# Altium project Project.PrjPCB
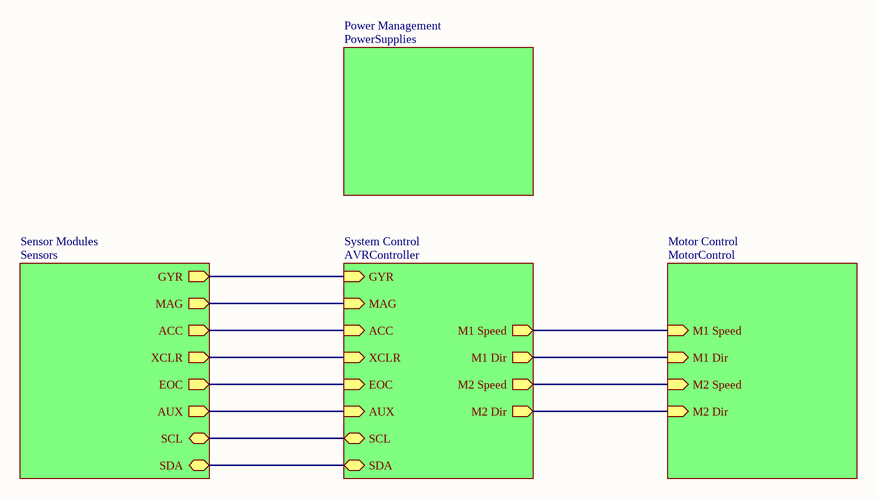
[diagram p0: Project.SchDoc]
5 sheets, 65 parts. Net scope: hierarchical (ports join the sheet entries above them; power ports are global).
Board file: Project.PcbDoc
Sheets:
  Project.SchDoc
    System Control = AVRController.SchDoc
    Motor Control = MotorControl.SchDoc
    Sensor Modules = Sensors.SchDoc
    Power Management = PowerSupplies.SchDoc

## Sheet Project.SchDoc
size A4

### Sub-sheets
Motor Control = MotorControl: M1 Speed (in), M1 Dir (in), M2 Speed (in), M2 Dir (in)
Power Management = PowerSupplies: no entries
Sensor Modules = Sensors: GYR (out), MAG (out), ACC (out), XCLR (out), EOC (out), AUX (out), SCL (bidir), SDA (bidir)
System Control = AVRController: GYR (in), MAG (in), ACC (in), XCLR (in), EOC (in), AUX (in), SCL (bidir), SDA (bidir), M1 Speed (out), M1 Dir (out), M2 Speed (out), M2 Dir (out)

### Nets
NetR12_2: sheet System Control/M1 Dir, sheet Motor Control/M1 Dir
NetR14_2: sheet System Control/M2 Dir, sheet Motor Control/M2 Dir
NetR17_1: sheet System Control/SDA, sheet Sensor Modules/SDA
NetR18_1: sheet System Control/SCL, sheet Sensor Modules/SCL
NetU1_2: sheet System Control/GYR, sheet Sensor Modules/GYR
NetU1_3: sheet System Control/MAG, sheet Sensor Modules/MAG
NetU1_4: sheet System Control/ACC, sheet Sensor Modules/ACC
NetU1_5: sheet System Control/XCLR, sheet Sensor Modules/XCLR
NetU1_7: sheet System Control/M1 Speed, sheet Motor Control/M1 Speed
NetU1_8: sheet System Control/M2 Speed, sheet Motor Control/M2 Speed
NetU1_12: sheet System Control/EOC, sheet Sensor Modules/EOC
(unnamed): sheet System Control/AUX, sheet Sensor Modules/AUX

## Sheet AVRController.SchDoc
size A4
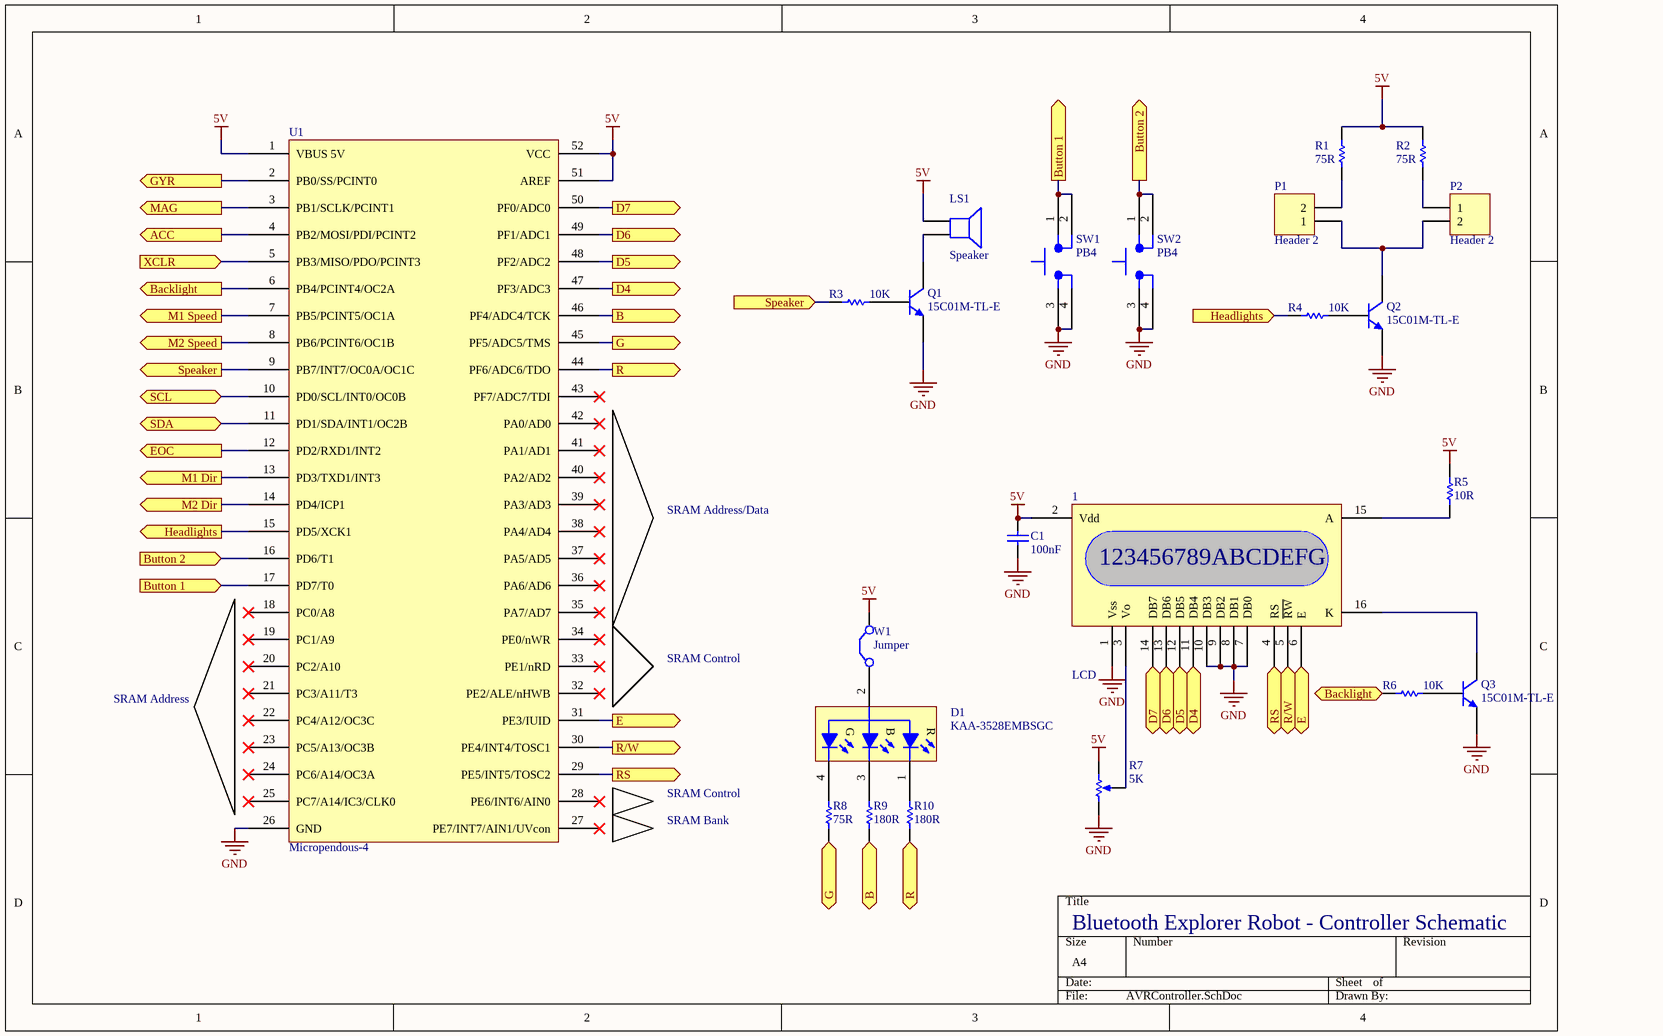
[diagram p1: AVRController.SchDoc]

### Parts
1  LCD  [LCD_PADS]
C1  value 100nF  [2012[0805]]
D1  KAA-3528EMBSGC  [KAA-3528EMBSGC]
LS1  Speaker  [PIN2]
P1  Header 2  [HDR1X2]
P2  Header 2  [HDR1X2]
Q1  15C01M-TL-E  [SOT323]
Q2  15C01M-TL-E  [SOT323]
Q3  15C01M-TL-E  [SOT323]
R1  value 75R  [2012[0805]]  (hidden comment: Res Semi)
R2  value 75R  [2012[0805]]  (hidden comment: Res Semi)
R3  value 10K  [2012[0805]]  (hidden comment: Res Semi)
R4  value 10K  [2012[0805]]  (hidden comment: Res Semi)
R5  value 10R  [2012[0805]]
R6  value 10K  [2012[0805]]  (hidden comment: Res Semi)
R7  value 5K  [POT1]
R8  value 75R  [2012[0805]]  (hidden comment: Res Semi)
R9  value 180R  [2012[0805]]  (hidden comment: Res Semi)
R10  value 180R  [2012[0805]]  (hidden comment: Res Semi)
SW1  PB4  [PB2x2]
SW2  PB4  [PB2x2]
U1  Micropendous-4  [Micropendous-4]
W1  Jumper  [RAD-0.2]

### Ports
ACC (out), B (in), B (out), Backlight (in), Backlight (out), Button 1 (in), Button 1 (out), Button 2 (in), Button 2 (out), D4 (in), D4 (out), D5 (in), D5 (out), D6 (in), D6 (out), D7 (in), D7 (out), E (in), E (out), EOC (out), G (in), G (out), GYR (out), Headlights (in), Headlights (out), M1 Dir (out), M1 Speed (out), M2 Dir (out), M2 Speed (out), MAG (out), R (in), R (out), R/W (in), R/W (out), RS (in), RS (out), SCL (bidir), SDA (bidir), Speaker (in), Speaker (out), XCLR (in)

### Nets
5V: 1.2(Vdd) C1.1 LS1.1 R1.2 R2.2 R5.2 R7.2(BOT) U1.1(VBUS_5V) U1.51(AREF) U1.52(VCC) W1.2(C2)
GND: 1.1(Vss) 1.7(DB0) 1.8(DB1) 1.9(DB2) 1.10(DB3) C1.2 Q1.1(E) Q2.1(E) Q3.1(E) R7.1(TOP) SW1.3 SW1.4 SW2.3 SW2.4 U1.26(GND)
Net1_3: 1.3(Vo) R7.3(TAP)
Net1_4: 1.4(RS) U1.29(PE5/INT5/TOSC2) ; port RS
Net1_5: 1.5(~{RW}) U1.30(PE4/INT4/TOSC1) ; port R/W
Net1_6: 1.6(E) U1.31(PE3/IUID) ; port E
Net1_11: 1.11(DB4) U1.47(PF3/ADC3) ; port D4
Net1_12: 1.12(DB5) U1.48(PF2/ADC2) ; port D5
Net1_13: 1.13(DB6) U1.49(PF1/ADC1) ; port D6
Net1_14: 1.14(DB7) U1.50(PF0/ADC0) ; port D7
Net1_15: 1.15(A) R5.1
Net1_16: 1.16(K) Q3.3(C)
NetD1_1: D1.1(R) R10.2
NetD1_2: D1.2(A2) W1.1(C1)
NetD1_3: D1.3(B) R9.2
NetD1_4: D1.4(G) R8.2
NetLS1_2: LS1.2 Q1.3(C)
NetP1_1: P1.1 P2.2 Q2.3(C)
NetP1_2: P1.2 R1.1
NetP2_1: P2.1 R2.1
NetQ1_2: Q1.2(B) R3.2
NetQ2_2: Q2.2(B) R4.2
NetQ3_2: Q3.2(B) R6.2
NetR3_1: R3.1 U1.9(PB7/INT7/OC0A/OC1C) ; port Speaker
NetR4_1: R4.1 U1.15(PD5/XCK1) ; port Headlights
NetR6_1: R6.1 U1.6(PB4/PCINT4/OC2A) ; port Backlight
NetR8_1: R8.1 U1.45(PF5/ADC5/TMS) ; port G
NetR9_1: R9.1 U1.46(PF4/ADC4/TCK) ; port B
NetR10_1: R10.1 U1.44(PF6/ADC6/TDO) ; port R
NetR12_2: U1.13(PD3/TXD1/INT3) ; port M1 Dir
NetR14_2: U1.14(PD4/ICP1) ; port M2 Dir
NetR17_1: U1.11(PD1/SDA/INT1/OC2B) ; port SDA
NetR18_1: U1.10(PD0/SCL/INT0/OC0B) ; port SCL
NetSW1_1: SW1.1 SW1.2 U1.17(PD7/T0) ; port Button 1
NetSW2_1: SW2.1 SW2.2 U1.16(PD6/T1) ; port Button 2
NetU1_2: U1.2(PB0/SS/PCINT0) ; port GYR
NetU1_3: U1.3(PB1/SCLK/PCINT1) ; port MAG
NetU1_4: U1.4(PB2/MOSI/PDI/PCINT2) ; port ACC
NetU1_5: U1.5(PB3/MISO/PDO/PCINT3) ; port XCLR
NetU1_7: U1.7(PB5/PCINT5/OC1A) ; port M1 Speed
NetU1_8: U1.8(PB6/PCINT6/OC1B) ; port M2 Speed
NetU1_12: U1.12(PD2/RXD1/INT2) ; port EOC

Not connected (* = marked no-connect by the designer): U1 18(PC0/A8)* 19(PC1/A9)* 20(PC2/A10)* 21(PC3/A11/T3)* 22(PC4/A12/OC3C)* 23(PC5/A13/OC3B)* 24(PC6/A14/OC3A)* 25(PC7/A14/IC3/CLK0)* 27(PE7/INT7/AIN1/UVcon)* 28(PE6/INT6/AIN0)* 32(PE2/ALE/nHWB)* 33(PE1/nRD)* 34(PE0/nWR)* 35(PA7/AD7)* 36(PA6/AD6)* 37(PA5/AD5)* 38(PA4/AD4)* 39(PA3/AD3)* 40(PA2/AD2)* 41(PA1/AD1)* 42(PA0/AD0)* 43(PF7/ADC7/TDI)*

### Notes on the sheet
- SRAM Address/Data
- SRAM Address
- SRAM Control
- SRAM Bank
- Bluetooth Explorer Robot - Controller Schematic
- (in symbol LCD) 123456789ABCDEFG

### Library data of the parts
C1 = Cap Semi: Capacitor (Semiconductor SIM Model); Published: 8-Jun-2000; LatestRevisionDate: 17-Jul-2002; LatestRevisionNote: Re-released for DXP Platform.; PackageReference: C1206; Publisher: Altium Limited
D1 = S1204RGBSDJC: Ultra-Bright RGB Tri-color LED Lamp, 4-Lead 1204-size SMD; Published: 14-Mar-2008; DatasheetVersion: Aug-2006; PackageVersion: Aug-2006; PackageReference: LED1204; Publisher: Altium Limited; PackageDescription: SM Tri-color LED Lamp, 4-Leads 1204-size; ComponentLink1Description: Manufacturer Link; ComponentLink1URL: http://www.sansentech.com/; ComponentLink2Description: Datasheet; ComponentLink2URL: http://www.sansentech.com/LED/S1204RGBSDJC.pdf
LS1 = Speaker: Loudspeaker; Published: 24-Mar-1999; LatestRevisionDate: 17-Jul-2002; LatestRevisionNote: Re-released for DXP Platform.; PackageReference: PIN2; Publisher: Altium Limited
P1 P2 = Header 2: Header, 2-Pin; LatestRevisionDate: 17-Jul-2002; LatestRevisionNote: Re-released for DXP Platform.; Publisher: Altium Limited
Q1-Q3 = 2N3904: NPN General Purpose Amplifier; Published: 8-Jun-2000; LatestRevisionDate: 15-Jan-2003; LatestRevisionNote: PCB Footprint 'BCY-W3/D4.7' replaced; DatasheetVersion: 1997; PackageVersion: Sep-1998; PackageReference: TO-92A; Publisher: Altium Limited; Code_JEDEC: TO-92A; ComponentLink1Description: Manufacturer Link; ComponentLink1URL: http://www.fairchildsemi.com/; ComponentLink2Description: Datasheet; ComponentLink2URL: http://www.fairchildsemi.com/ds/2N%2F2N3904.pdf
R1-R4 R6 R8-R10 = Res Semi: Semiconductor Resistor; Published: 8-Jun-2000; LatestRevisionDate: 17-Jul-2002; LatestRevisionNote: Re-released for DXP Platform.; PackageReference: AXIAL-0.5; Publisher: Altium Limited
R5 = Res1: Resistor; Published: 8-Jun-2000; LatestRevisionDate: 17-Jul-2002; LatestRevisionNote: Re-released for DXP Platform.; PackageReference: AXIAL-0.3; Publisher: Altium Limited
R7 = RPot: Potentiometer; Sim Note: Enter the Resistance value and the set point into parameter fields.; Set Position: 0.5; Published: 8-Jun-2000; LatestRevisionDate: 17-Jul-2002; LatestRevisionNote: Re-released for DXP Platform.; PackageReference: VR5; Publisher: Altium Limited
W1 = Jumper: Jumper Wire; Published: 24-Mar-1999; LatestRevisionDate: 17-Jul-2002; LatestRevisionNote: Re-released for DXP Platform.; PackageReference: RAD-0.2; Publisher: Altium Limited

## Sheet MotorControl.SchDoc
size A4
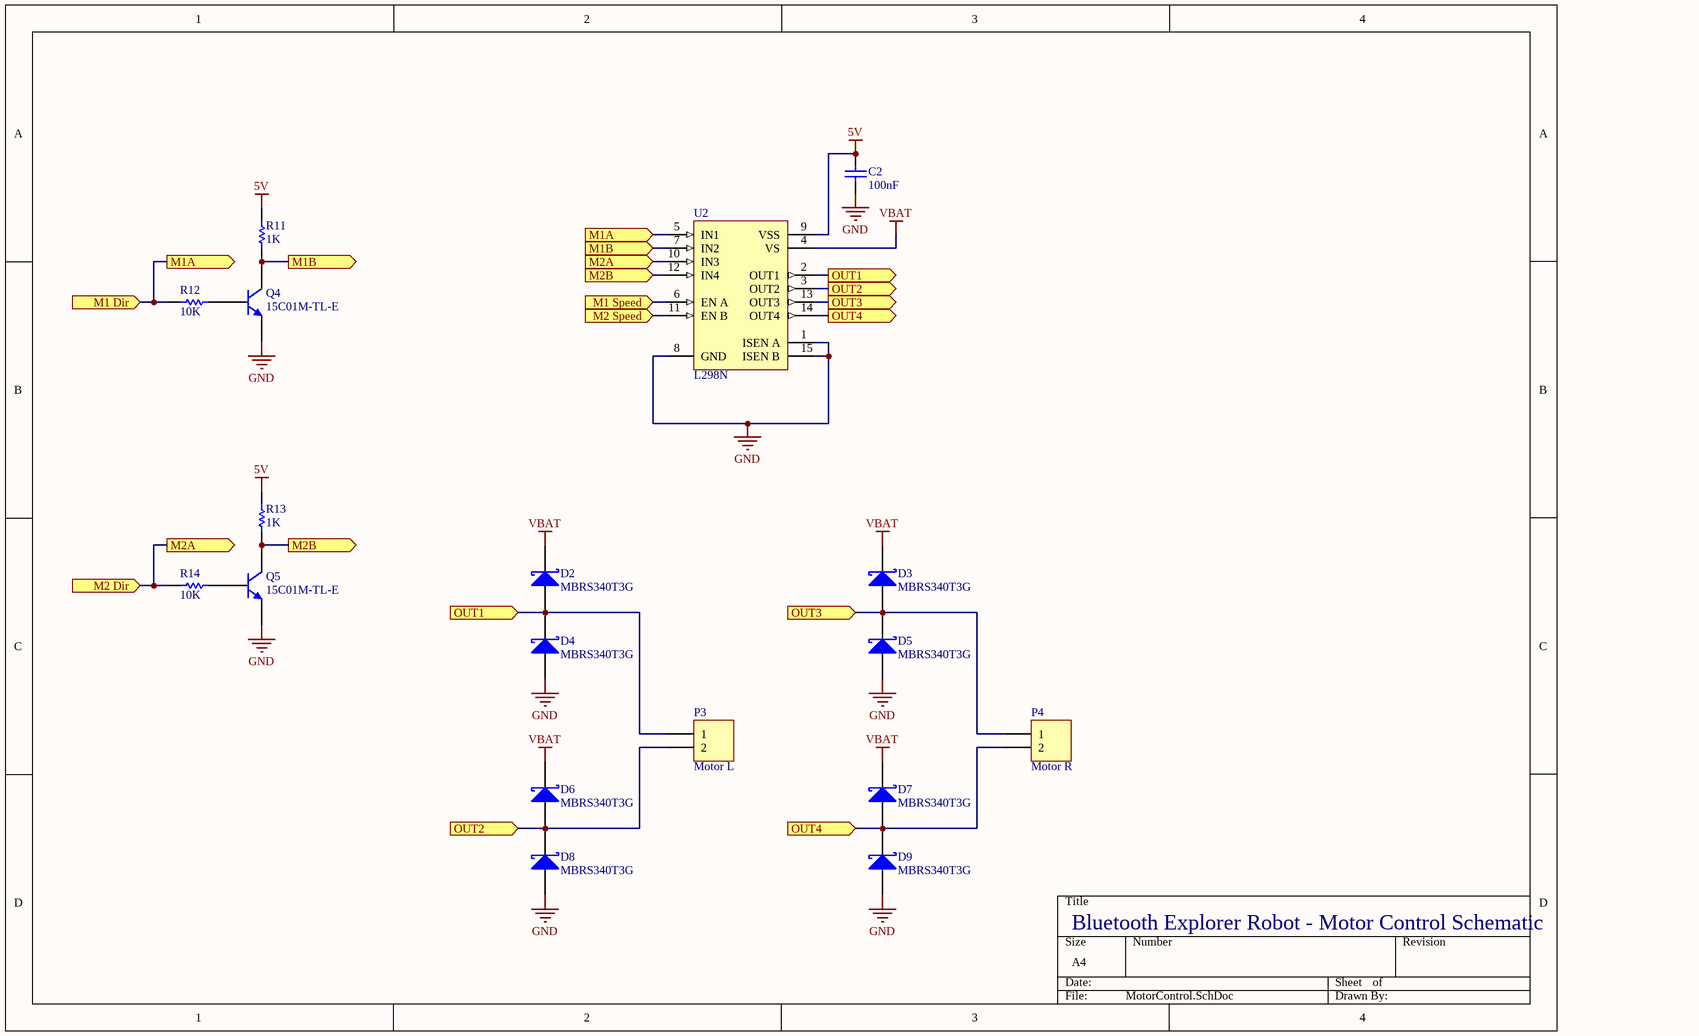
[diagram p2: MotorControl.SchDoc]

### Parts
C2  value 100nF  [0805]
D2  MBRS340T3G  [SMC]
D3  MBRS340T3G  [SMC]
D4  MBRS340T3G  [SMC]
D5  MBRS340T3G  [SMC]
D6  MBRS340T3G  [SMC]
D7  MBRS340T3G  [SMC]
D8  MBRS340T3G  [SMC]
D9  MBRS340T3G  [SMC]
P3  Motor L  [PCB Screw Connector]
P4  Motor R  [PCB Screw Connector]
Q4  15C01M-TL-E  [SOT323]
Q5  15C01M-TL-E  [SOT323]
R11  value 1K  [2012[0805]]  (hidden comment: Res Semi)
R12  value 10K  [2012[0805]]  (hidden comment: Res Semi)
R13  value 1K  [2012[0805]]  (hidden comment: Res Semi)
R14  value 10K  [2012[0805]]  (hidden comment: Res Semi)
U2  L298N  [Multiwatt15V]

### Ports
M1 Dir (in), M1 Speed (in), M1A (in), M1A (out), M1B (in), M1B (out), M2 Dir (in), M2 Speed (in), M2A (in), M2A (out), M2B (in), M2B (out), OUT1 (in), OUT1 (out), OUT2 (in), OUT2 (out), OUT3 (in), OUT3 (out), OUT4 (in), OUT4 (out)

### Nets
5V: C2.1 R11.2 R13.2 U2.9(VSS)
GND: C2.2 D4.1(A) D5.1(A) D8.1(A) D9.1(A) Q4.1(E) Q5.1(E) U2.1(ISEN_A) U2.8(GND) U2.15(ISEN_B)
VBAT: D2.2(K) D3.2(K) D6.2(K) D7.2(K) U2.4(VS)
NetD2_1: D2.1(A) D4.2(K) P3.1 U2.2(OUT1) ; port OUT1
NetD3_1: D3.1(A) D5.2(K) P4.1 U2.13(OUT3) ; port OUT3
NetD6_1: D6.1(A) D8.2(K) P3.2 U2.3(OUT2) ; port OUT2
NetD7_1: D7.1(A) D9.2(K) P4.2 U2.14(OUT4) ; port OUT4
NetQ4_2: Q4.2(B) R12.1
NetQ4_3: Q4.3(C) R11.1 U2.7(IN2) ; port M1B
NetQ5_2: Q5.2(B) R14.1
NetQ5_3: Q5.3(C) R13.1 U2.12(IN4) ; port M2B
NetR12_2: R12.2 U2.5(IN1) ; port M1 Dir, port M1A
NetR14_2: R14.2 U2.10(IN3) ; port M2 Dir, port M2A
NetU1_7: U2.6(EN_A) ; port M1 Speed
NetU1_8: U2.11(EN_B) ; port M2 Speed

### Notes on the sheet
- Bluetooth Explorer Robot - Motor Control Schematic

### Library data of the parts
C2 = Cap Semi: Capacitor (Semiconductor SIM Model); Published: 8-Jun-2000; LatestRevisionDate: 17-Jul-2002; LatestRevisionNote: Re-released for DXP Platform.; PackageReference: C1206; Publisher: Altium Limited
D2-D9 = D Schottky: Schottky Diode; Published: 8-Jun-2000; LatestRevisionDate: 17-Jul-2002; LatestRevisionNote: Re-released for DXP Platform.; PackageReference: SMB; Publisher: Altium Limited; Code_JEDEC: DO-214-AA
P3 P4 = Header 2: Header, 2-Pin; LatestRevisionDate: 17-Jul-2002; LatestRevisionNote: Re-released for DXP Platform.; Publisher: Altium Limited
Q4 Q5 = 2N3904: NPN General Purpose Amplifier; Published: 8-Jun-2000; LatestRevisionDate: 15-Jan-2003; LatestRevisionNote: PCB Footprint 'BCY-W3/D4.7' replaced; DatasheetVersion: 1997; PackageVersion: Sep-1998; PackageReference: TO-92A; Publisher: Altium Limited; Code_JEDEC: TO-92A; ComponentLink1Description: Manufacturer Link; ComponentLink1URL: http://www.fairchildsemi.com/; ComponentLink2Description: Datasheet; ComponentLink2URL: http://www.fairchildsemi.com/ds/2N%2F2N3904.pdf
R11-R14 = Res Semi: Semiconductor Resistor; Published: 8-Jun-2000; LatestRevisionDate: 17-Jul-2002; LatestRevisionNote: Re-released for DXP Platform.; PackageReference: AXIAL-0.5; Publisher: Altium Limited
U2 = L298N: Dual Full Bridge Driver; Published: 8-Jun-2000; LatestRevisionDate: 14-May-2007; LatestRevisionNote: Mapped to vertical PCB.; DatasheetVersion: Jul-1999; PackageReference: Multiwatt15V; Publisher: Altium Limited; PackageDescription: TO, Thru-Hole, Vertical, Heatsink Mounted; 15 Bent Staggered Leads; Pitch 1.27 mm; ComponentLink1Description: Manufacturer Link; ComponentLink1URL: http://www.st.com/; ComponentLink2Description: Datasheet; ComponentLink2URL: http://www.st.com/stonline/products/literature/ds/1773/l298.pdf

## Sheet Sensors.SchDoc
size A4
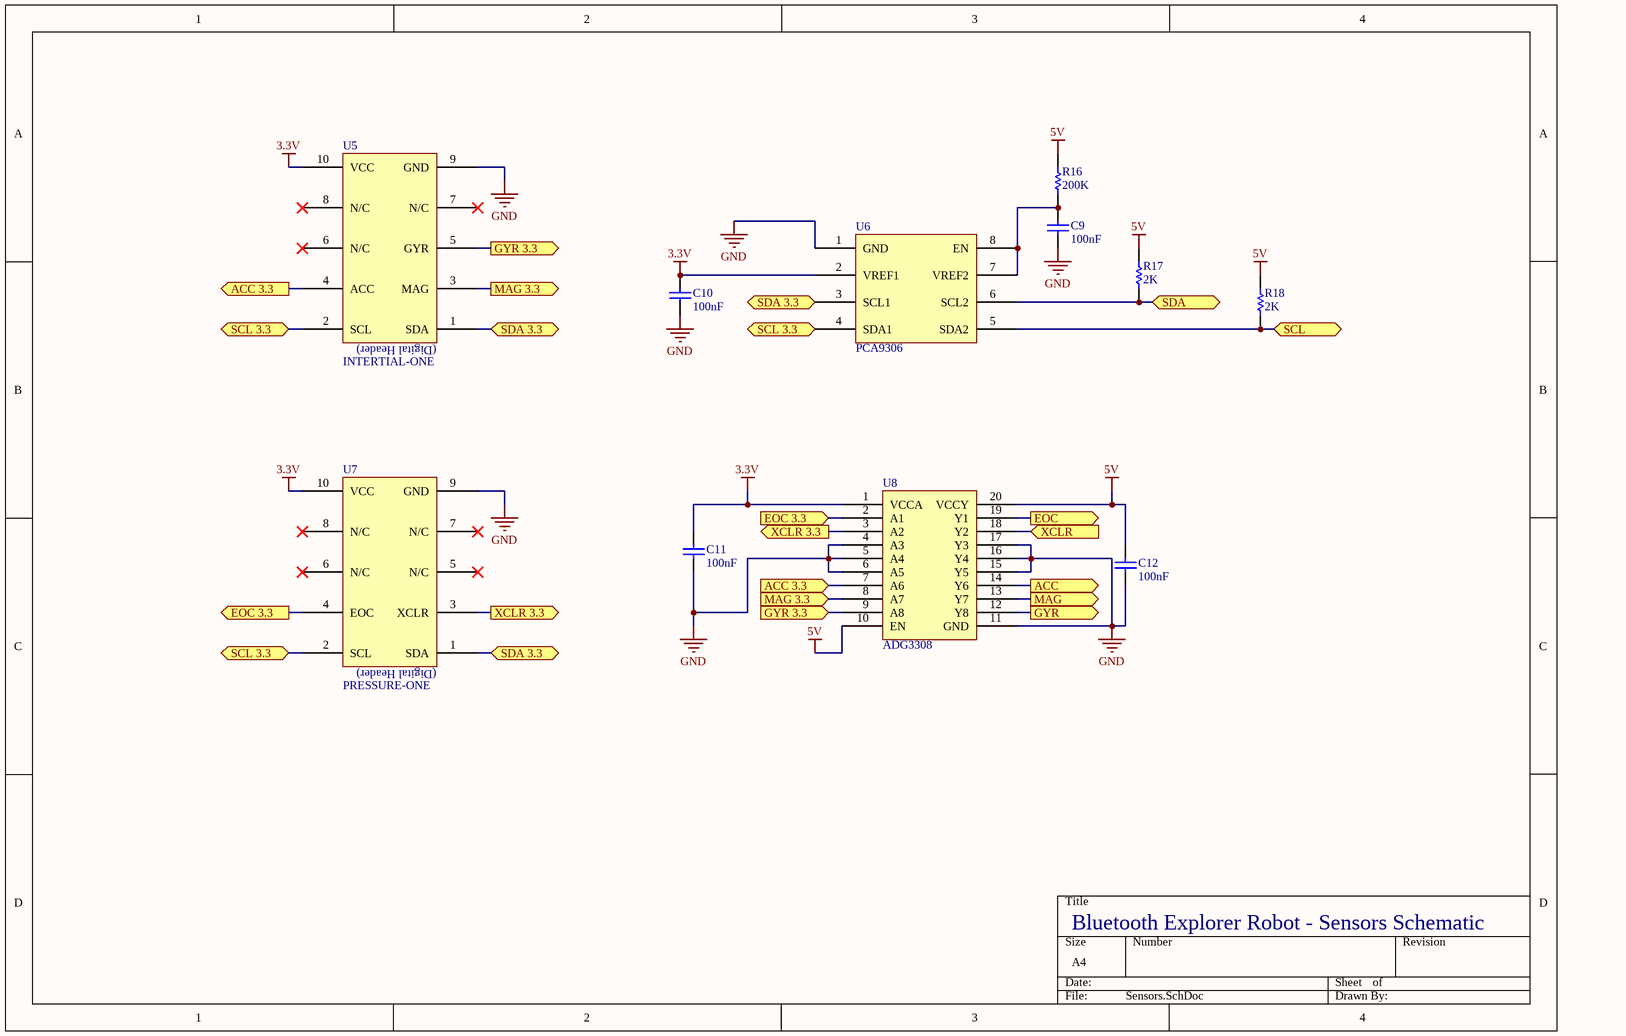
[diagram p3: Sensors.SchDoc]

### Parts
C9  value 100nF  [0805]
C10  value 100nF  [0805]
C11  value 100nF  [0805]
C12  value 100nF  [0805]
R16  value 200K  [2012[0805]]  (hidden comment: Res Semi)
R17  value 2K  [2012[0805]]  (hidden comment: Res Semi)
R18  value 2K  [2012[0805]]  (hidden comment: Res Semi)
U5  INTERTIAL-ONE  [ATMEL-SENS]
U6  PCA9306  [us8]
U7  PRESSURE-ONE  [ATMEL-SENS]
U8  ADG3308  [TSSOP20]

### Ports
ACC 3.3 (in), ACC 3.3 (out), ACC (out), EOC 3.3 (in), EOC 3.3 (out), EOC (out), GYR 3.3 (in), GYR 3.3 (out), GYR (out), MAG 3.3 (in), MAG 3.3 (out), MAG (out), SCL 3.3 (bidir), SCL (bidir), SDA 3.3 (bidir), SDA (bidir), XCLR 3.3 (out), XCLR (in)

### Nets
3.3V: C10.1 C11.1 U5.10(VCC) U6.2(VREF1) U7.10(VCC) U8.1(VCCA)
5V: C12.1 R16.2 R17.2 R18.2 U8.10(EN) U8.20(VCCY)
GND: C9.2 C10.2 C11.2 C12.2 U5.9(GND) U6.1(GND) U7.9(GND) U8.4(A3) U8.5(A4) U8.6(A5) U8.11(GND) U8.15(Y5) U8.16(Y4) U8.17(Y3)
NetC9_1: C9.1 R16.1 U6.7(VREF2) U6.8(EN)
NetR17_1: R17.1 U6.6(SCL2) ; port SDA
NetR18_1: R18.1 U6.5(SDA2) ; port SCL
NetU1_2: U8.12(Y8) ; port GYR
NetU1_3: U8.13(Y7) ; port MAG
NetU1_4: U8.14(Y6) ; port ACC
NetU1_5: U8.18(Y2) ; port XCLR
NetU1_12: U8.19(Y1) ; port EOC
NetU5_1: U5.1(SDA) U6.3(SCL1) U7.1(SDA) ; port SDA 3.3
NetU5_2: U5.2(SCL) U6.4(SDA1) U7.2(SCL) ; port SCL 3.3
NetU5_3: U5.3(MAG) U8.8(A7) ; port MAG 3.3
NetU5_4: U5.4(ACC) U8.7(A6) ; port ACC 3.3
NetU5_5: U5.5(GYR) U8.9(A8) ; port GYR 3.3
NetU7_3: U7.3(XCLR) U8.3(A2) ; port XCLR 3.3
NetU7_4: U7.4(EOC) U8.2(A1) ; port EOC 3.3

Not connected (* = marked no-connect by the designer): U5 6(N/C)* 7(N/C)* 8(N/C)*; U7 5(N/C)* 6(N/C)* 7(N/C)* 8(N/C)*

### Notes on the sheet
- Bluetooth Explorer Robot - Sensors Schematic
- (in symbol INTERTIAL-ONE) (Digital Header)
- (in symbol PRESSURE-ONE) (Digital Header)

### Library data of the parts
C9-C12 = Cap Semi: Capacitor (Semiconductor SIM Model); Published: 8-Jun-2000; LatestRevisionDate: 17-Jul-2002; LatestRevisionNote: Re-released for DXP Platform.; PackageReference: C1206; Publisher: Altium Limited
R16-R18 = Res Semi: Semiconductor Resistor; Published: 8-Jun-2000; LatestRevisionDate: 17-Jul-2002; LatestRevisionNote: Re-released for DXP Platform.; PackageReference: AXIAL-0.5; Publisher: Altium Limited

## Sheet PowerSupplies.SchDoc
size A4
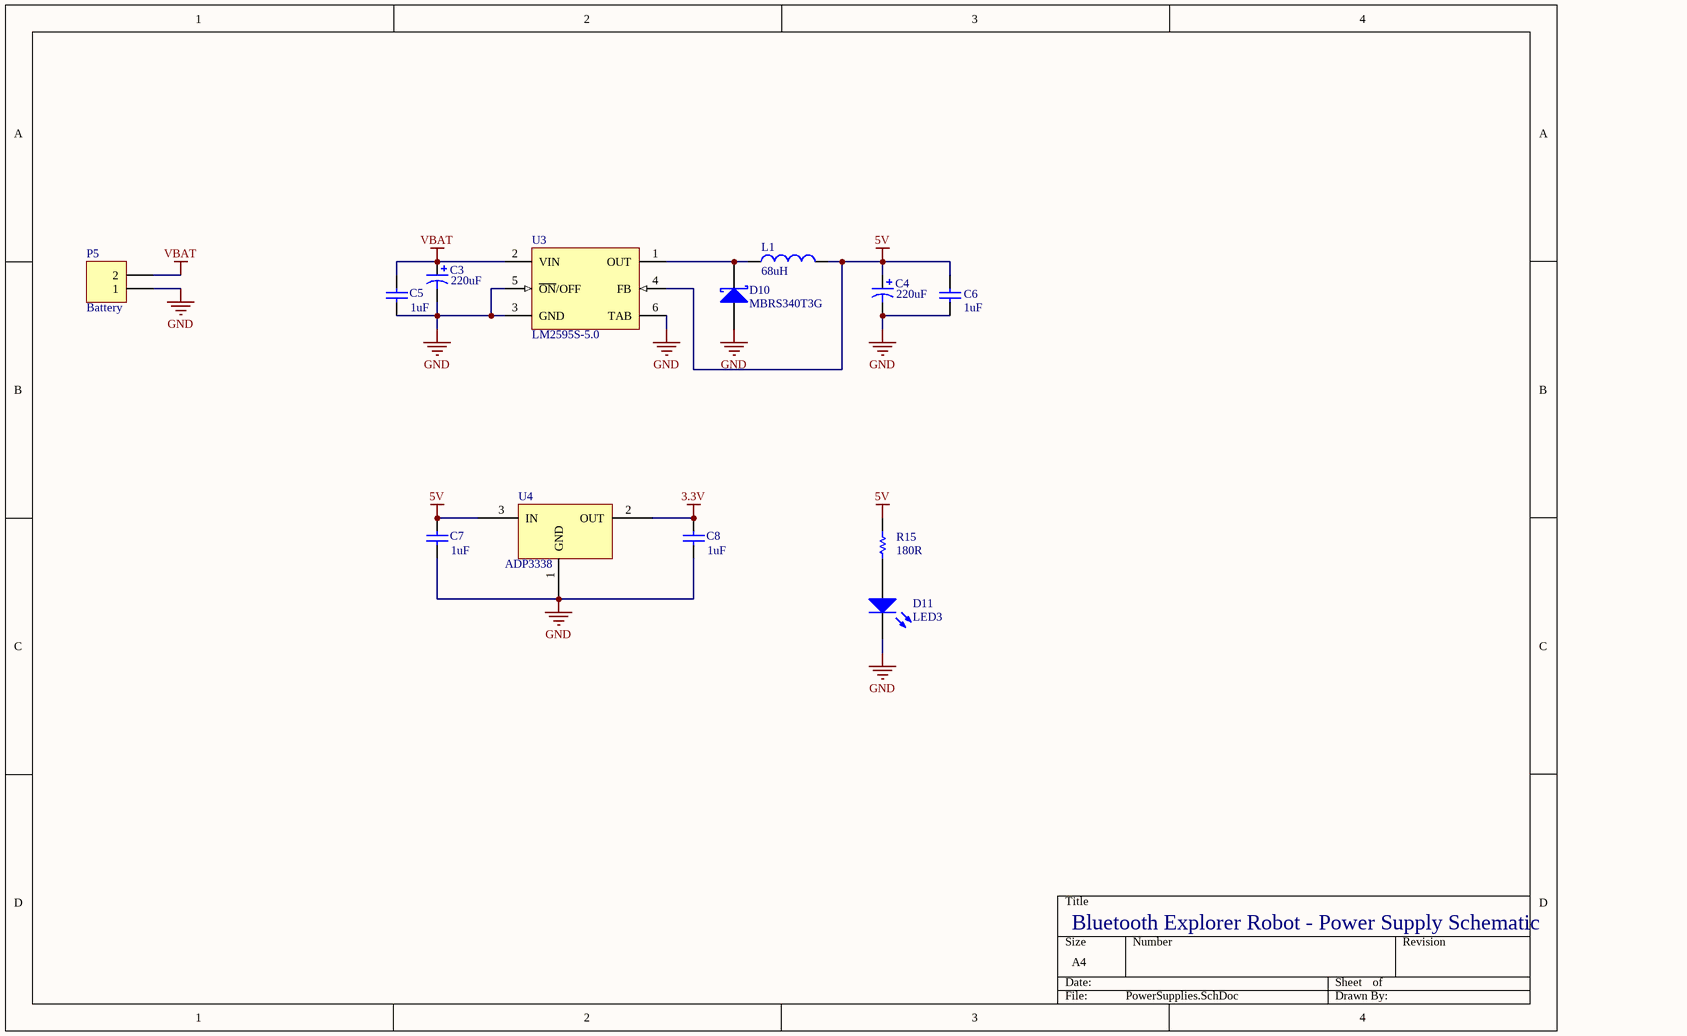
[diagram p4: PowerSupplies.SchDoc]

### Parts
C3  value 220uF  [Cap F]  (hidden comment: Cap Pol1)
C4  value 220uF  [Cap F]  (hidden comment: Cap Pol1)
C5  value 1uF  [C0805]  (hidden comment: Cap Semi)
C6  value 1uF  [C0805]  (hidden comment: Cap Semi)
C7  value 1uF  [C0805]  (hidden comment: Cap Semi)
C8  value 1uF  [C0805]  (hidden comment: Cap Semi)
D10  MBRS340T3G  [SMC]
D11  LED3  [DSO-C2/D5.6]
L1  value 68uH  [inductor_epcos]
P5  Battery  [PCB Screw Connector]
R15  value 180R  [2012[0805]]  (hidden comment: Res Semi)
U3  LM2595S-5.0  [TS5B_N]
U4  ADP3338  [SOT223-4l]

### Nets
3.3V: C8.2 U4.2(OUT)
5V: C4.1 C6.2 C7.2 L1.2 R15.2 U3.4(FB) U4.3(IN)
GND: C3.2 C4.2 C5.1 C6.1 C7.1 C8.1 D10.1(A) D11.2(K) P5.1 U3.3(GND) U3.5(~{ON}/OFF) U3.6(TAB) U4.1(GND)
VBAT: C3.1 C5.2 P5.2 U3.2(VIN)
NetD10_2: D10.2(K) L1.1 U3.1(OUT)
NetD11_1: D11.1(A) R15.1

### Notes on the sheet
- Bluetooth Explorer Robot - Power Supply Schematic

### Library data of the parts
C3 C4 = Cap Pol1: Polarized Capacitor (Radial); Published: 8-Jun-2000; LatestRevisionDate: 17-Jul-2002; LatestRevisionNote: Re-released for DXP Platform.; PackageReference: RB7.6-15; Publisher: Altium Limited
C5-C8 = Cap Semi: Capacitor (Semiconductor SIM Model); Published: 8-Jun-2000; LatestRevisionDate: 29-May-2009; LatestRevisionNote: IPC-7351 Footprint Added.; PackageReference: C1206; Publisher: Altium Limited; PackageDescription: Chip Capacitor
D10 = D Schottky: Schottky Diode; Published: 8-Jun-2000; LatestRevisionDate: 17-Jul-2002; LatestRevisionNote: Re-released for DXP Platform.; PackageReference: SMB; Publisher: Altium Limited; Code_JEDEC: DO-214-AA
D11 = LED3: Typical BLUE SiC LED; Published: 8-Jun-2000; LatestRevisionDate: 17-Dec-2003; LatestRevisionNote: PCB Footprint replaced.; DatasheetVersion: 16-Apr-2002; PackageVersion: 16-Apr-2002; PackageReference: 3.5X2.8X1.9; Publisher: Altium Limited
L1 = Inductor: Code_IEC: 1005; Published: 8-Jun-2000; LatestRevisionDate: 17-Jul-2002; LatestRevisionNote: Re-released for DXP Platform.; PackageReference: 0402-A; Publisher: Altium Limited; Code_JEITA: 0402
P5 = Header 2: Header, 2-Pin; LatestRevisionDate: 17-Jul-2002; LatestRevisionNote: Re-released for DXP Platform.; Publisher: Altium Limited
R15 = Res Semi: Semiconductor Resistor; Published: 8-Jun-2000; LatestRevisionDate: 17-Jul-2002; LatestRevisionNote: Re-released for DXP Platform.; PackageReference: AXIAL-0.5; Publisher: Altium Limited
U3 = LM2595S-5.0: SIMPLE SWITCHER Power Converter 150 KHz 1A Step-Down Voltage Regulator; Manufacturer: National Semiconductor; PackageTopMarking: NSUZXYTT*LM2595S*-5.0 P+; PowerWise: N; FirstPublished: 4-Dec-2008; DatasheetVersion: May-1999; PackageVersion: revD, Apr-2005; PackageReference: TS5B; Publisher: Altium Limited; PackageDescription: TO-263, Molded, .400 x .390 x .180in, 5 Lead, .067in Pitch, Surface Mount; CompType: Switcher; PartNumber: LM2595S-5.0; RoHS: O; PinCount: 5; DigiKeyPartNumber: LM2595S-5.0-ND; Code_JEDEC: MO-169-AB; ComponentLink1Description: LM2595 Datasheet; ComponentLink1URL: http://www.national.com/ds/LM/LM2595.pdf; ComponentLink2Description: LM2595 Web Page; ComponentLink2URL: http://www.national.com/pf/LM/LM2595.html; ComponentLink3Description: TS5B Package Page; ComponentLink3URL: http://www.national.com/packaging/folders/ts5b.html

## Nets that join several sheets
3.3V: Sensors (6 pins), PowerSupplies (C8.2 U4.2)
5V: AVRController (11 pins), MotorControl (C2.1 R11.2 R13.2 U2.9), Sensors (6 pins), PowerSupplies (7 pins)
GND: AVRController (15 pins), MotorControl (10 pins), Sensors (14 pins), PowerSupplies (13 pins)
VBAT: MotorControl (5 pins), PowerSupplies (C3.1 C5.2 P5.2 U3.2)
NetR12_2: AVRController (U1.13), MotorControl (R12.2 U2.5)
NetR14_2: AVRController (U1.14), MotorControl (R14.2 U2.10)
NetR17_1: AVRController (U1.11), Sensors (R17.1 U6.6)
NetR18_1: AVRController (U1.10), Sensors (R18.1 U6.5)
NetU1_2: AVRController (U1.2), Sensors (U8.12)
NetU1_3: AVRController (U1.3), Sensors (U8.13)
NetU1_4: AVRController (U1.4), Sensors (U8.14)
NetU1_5: AVRController (U1.5), Sensors (U8.18)
NetU1_7: AVRController (U1.7), MotorControl (U2.6)
NetU1_8: AVRController (U1.8), MotorControl (U2.11)
NetU1_12: AVRController (U1.12), Sensors (U8.19)